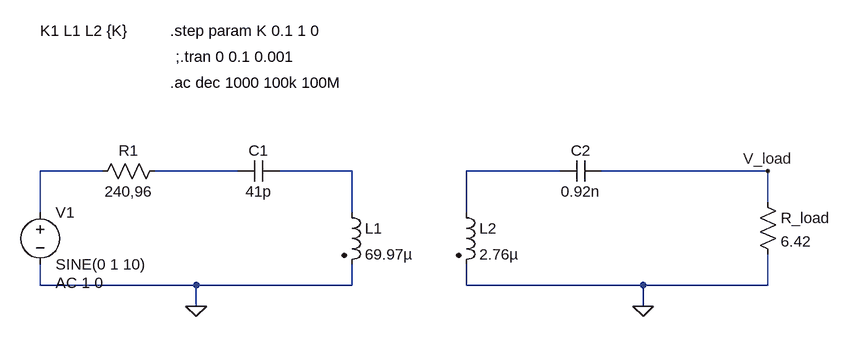
[diagram p0: schematic 2Coils_schematic.asc]
2Coils_schematic.asc, the LTspice schematic file:
Version 4
SHEET 1 1480 680
WIRE 80 160 -16 160
WIRE 288 160 160 160
WIRE 464 160 352 160
WIRE 784 160 640 160
WIRE 1104 160 848 160
WIRE 1104 208 1104 160
WIRE -16 224 -16 160
WIRE 464 224 464 160
WIRE 640 224 640 160
WIRE -16 336 -16 304
WIRE 224 336 -16 336
WIRE 464 336 464 304
WIRE 464 336 224 336
WIRE 640 336 640 304
WIRE 912 336 640 336
WIRE 1104 336 1104 288
WIRE 1104 336 912 336
WIRE 224 368 224 336
WIRE 912 368 912 336
FLAG 912 368 0
FLAG 224 368 0
FLAG 1104 160 V_load
SYMBOL res 176 144 R90
WINDOW 0 0 56 VBottom 2
WINDOW 3 32 56 VTop 2
SYMATTR InstName R1
SYMATTR Value 240,96
SYMBOL voltage -16 208 R0
WINDOW 123 24 124 Left 2
WINDOW 39 0 0 Left 0
SYMATTR Value2 AC 1 0
SYMATTR InstName V1
SYMATTR Value SINE(0 1 10)
SYMBOL cap 352 144 R90
WINDOW 0 0 32 VBottom 2
WINDOW 3 32 32 VTop 2
SYMATTR InstName C1
SYMATTR Value 41p
SYMBOL ind2 448 208 R0
SYMATTR InstName L1
SYMATTR Value 69.97µ
SYMATTR SpiceLine Rser=0
SYMATTR Type ind
SYMBOL ind2 624 208 R0
SYMATTR InstName L2
SYMATTR Value 2.76µ
SYMATTR Type ind
SYMBOL cap 848 144 R90
WINDOW 0 0 32 VBottom 2
WINDOW 3 32 32 VTop 2
SYMATTR InstName C2
SYMATTR Value 0.92n
SYMBOL res 1088 192 R0
SYMATTR InstName R_load
SYMATTR Value 6.42
TEXT -16 -56 Left 2 !K1 L1 L2 {K}
TEXT 184 -56 Left 2 !.step param K 0.1 1 0
TEXT 184 24 Left 2 !.ac dec 1000 100k 100M
TEXT 192 -16 Left 2 !;.tran 0 0.1 0.001

The netlist it stands for:
* 2Coils_schematic.asc
R1 N002 N001 240,96
V1 N001 0 SINE(0 1 10) AC 1 0
C1 N003 N002 41p
L1 N003 0 69.97µ Rser=0
L2 N004 0 2.76µ
C2 V_load N004 0.92n
R_load V_load 0 6.42
K1 L1 L2 {K}
.step param K 0.1 1 0
.ac dec 1000 100k 100M
;.tran 0 0.1 0.001
.backanno
.end